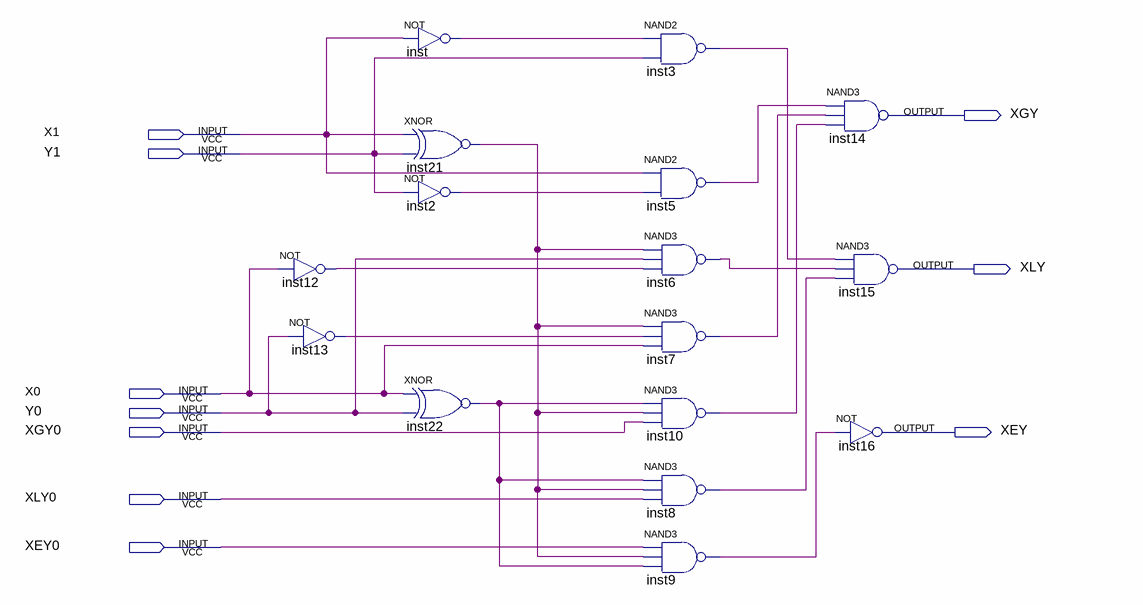
[diagram p0: schematic sheet]
// Quartus schematic cmp_g.bdf as structural Verilog: 16 symbols, 10 pins
module cmp_g (
  input  X1,
  input  Y1,
  input  X0,
  input  Y0,
  input  XGY0,
  input  XLY0,
  input  XEY0,
  output XGY,
  output XLY,
  output XEY
);

  wire inst2_out, inst3_out, inst5_out, inst6_out, inst7_out, inst8_out, inst9_out, inst10_out, inst12_out,
       inst13_out, inst21_out, inst22_out, inst_out;

  not inst12 (inst12_out, X0);
  not inst13 (inst13_out, Y0);
  not inst (inst_out, X1);
  xnor inst21 (inst21_out, X1, Y1);
  not inst2 (inst2_out, Y1);
  xnor inst22 (inst22_out, X0, Y0);
  nand inst3 (inst3_out, inst_out, Y1);
  nand inst5 (inst5_out, X1, inst2_out);
  nand inst6 (inst6_out, inst21_out, Y0, inst12_out);
  nand inst7 (inst7_out, inst21_out, inst13_out, X0);
  nand inst10 (inst10_out, inst22_out, inst21_out, XGY0);
  nand inst8 (inst8_out, inst22_out, inst21_out, XLY0);
  nand inst9 (inst9_out, XEY0, inst21_out, inst22_out);
  nand inst14 (XGY, inst5_out, inst7_out, inst10_out);
  nand inst15 (XLY, inst3_out, inst6_out, inst8_out);
  not inst16 (XEY, inst9_out);
endmodule
